# Altium project ic_tester.PrjPcb
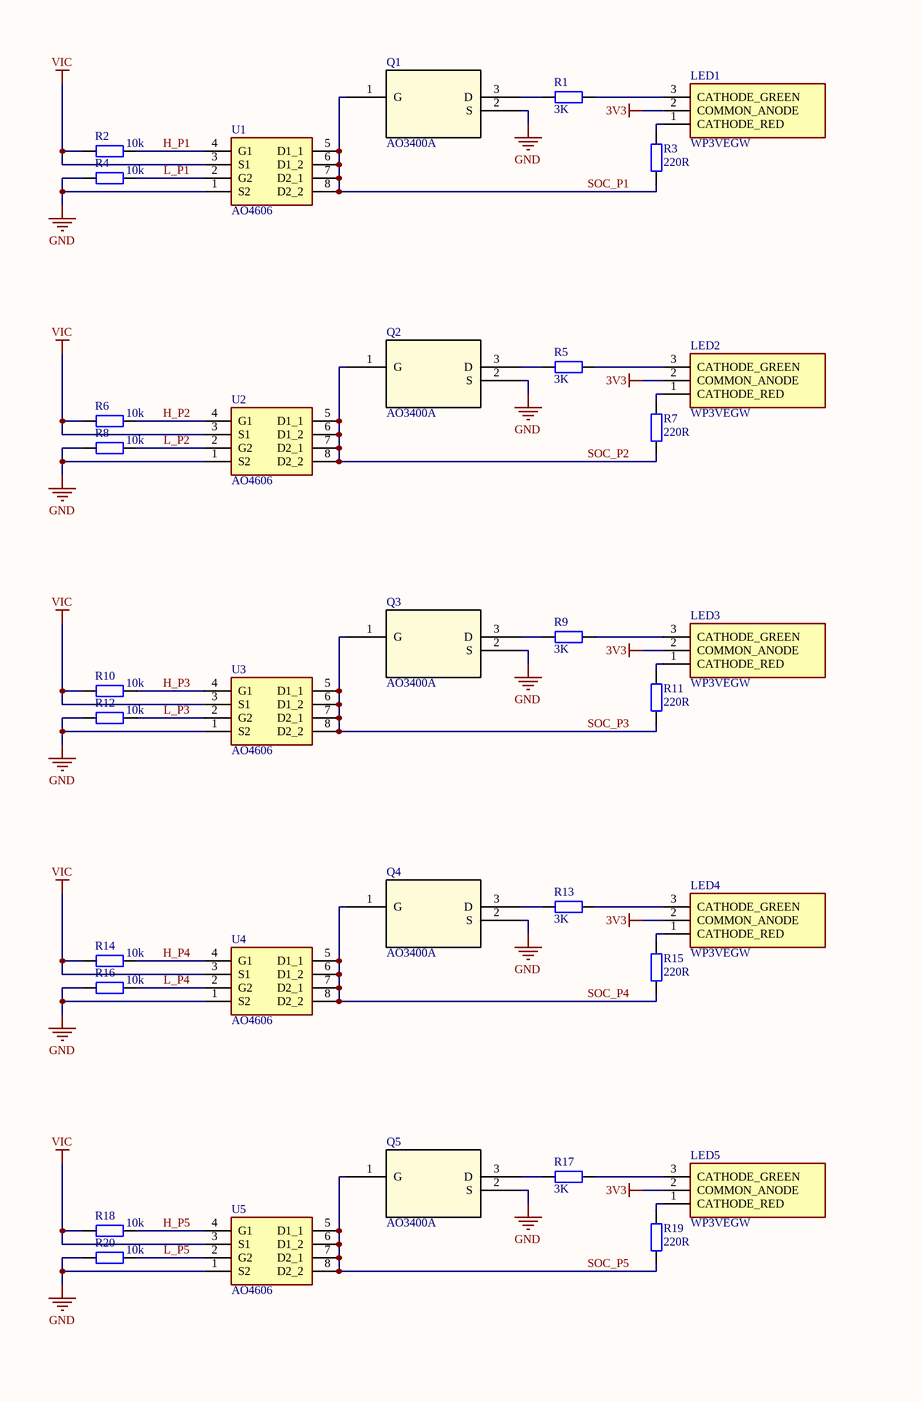
[diagram p0: data_left.SchDoc, top]
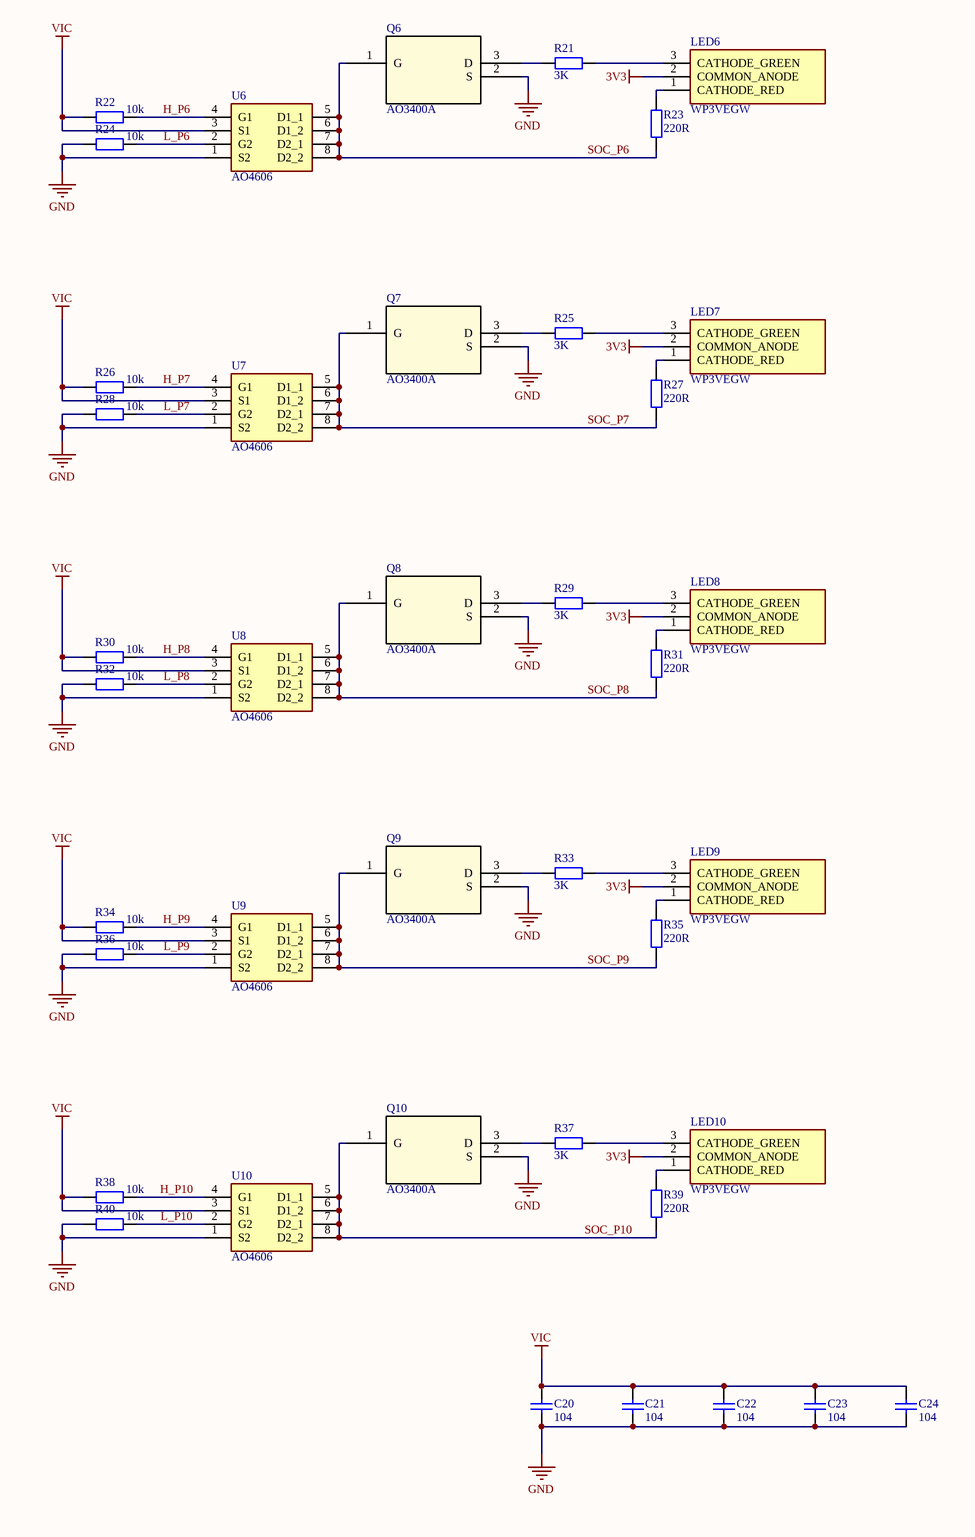
[diagram p1: data_left.SchDoc, bottom]
3 sheets, 236 parts. Net scope: global (net labels, ports and power ports of the same name join across sheets).
Board file: ic_tester.PcbDoc
Sheets:
  data_left.SchDoc
  data_right.SchDoc
  connect.SchDoc

## Sheet data_left.SchDoc
size 241 x 584 mm; SheetNumber: 1; SheetTotal: 3

### Parts
C20  104  [tu 0805]
C21  104  [tu 0805]
C22  104  [tu 0805]
C23  104  [tu 0805]
C24  104  [tu 0805]
LED1  WP3VEGW  [WP3VEGW]
LED2  WP3VEGW  [WP3VEGW]
LED3  WP3VEGW  [WP3VEGW]
LED4  WP3VEGW  [WP3VEGW]
LED5  WP3VEGW  [WP3VEGW]
LED6  WP3VEGW  [WP3VEGW]
LED7  WP3VEGW  [WP3VEGW]
LED8  WP3VEGW  [WP3VEGW]
LED9  WP3VEGW  [WP3VEGW]
LED10  WP3VEGW  [WP3VEGW]
Q1  AO3400A  [SOT-23-3L_AOS]
Q2  AO3400A  [SOT-23-3L_AOS]
Q3  AO3400A  [SOT-23-3L_AOS]
Q4  AO3400A  [SOT-23-3L_AOS]
Q5  AO3400A  [SOT-23-3L_AOS]
Q6  AO3400A  [SOT-23-3L_AOS]
Q7  AO3400A  [SOT-23-3L_AOS]
Q8  AO3400A  [SOT-23-3L_AOS]
Q9  AO3400A  [SOT-23-3L_AOS]
Q10  AO3400A  [SOT-23-3L_AOS]
R1  3K  [tro smd 0805]
R2  10k  [tro smd 0805]
R3  220R  [tro smd 0805]
R4  10k  [tro smd 0805]
R5  3K  [tro smd 0805]
R6  10k  [tro smd 0805]
R7  220R  [tro smd 0805]
R8  10k  [tro smd 0805]
R9  3K  [tro smd 0805]
R10  10k  [tro smd 0805]
R11  220R  [tro smd 0805]
R12  10k  [tro smd 0805]
R13  3K  [tro smd 0805]
R14  10k  [tro smd 0805]
R15  220R  [tro smd 0805]
R16  10k  [tro smd 0805]
R17  3K  [tro smd 0805]
R18  10k  [tro smd 0805]
R19  220R  [tro smd 0805]
R20  10k  [tro smd 0805]
R21  3K  [tro smd 0805]
R22  10k  [tro smd 0805]
R23  220R  [tro smd 0805]
R24  10k  [tro smd 0805]
R25  3K  [tro smd 0805]
R26  10k  [tro smd 0805]
R27  220R  [tro smd 0805]
R28  10k  [tro smd 0805]
R29  3K  [tro smd 0805]
R30  10k  [tro smd 0805]
R31  220R  [tro smd 0805]
R32  10k  [tro smd 0805]
R33  3K  [tro smd 0805]
R34  10k  [tro smd 0805]
R35  220R  [tro smd 0805]
R36  10k  [tro smd 0805]
R37  3K  [tro smd 0805]
R38  10k  [tro smd 0805]
R39  220R  [tro smd 0805]
R40  10k  [tro smd 0805]
U1  AO4606  [SOIC127P600X175-8N]
U2  AO4606  [SOIC127P600X175-8N]
U3  AO4606  [SOIC127P600X175-8N]
U4  AO4606  [SOIC127P600X175-8N]
U5  AO4606  [SOIC127P600X175-8N]
U6  AO4606  [SOIC127P600X175-8N]
U7  AO4606  [SOIC127P600X175-8N]
U8  AO4606  [SOIC127P600X175-8N]
U9  AO4606  [SOIC127P600X175-8N]
U10  AO4606  [SOIC127P600X175-8N]

### Nets
3V3: LED1.2(COMMON_ANODE) LED2.2(COMMON_ANODE) LED3.2(COMMON_ANODE) LED4.2(COMMON_ANODE) LED5.2(COMMON_ANODE) LED6.2(COMMON_ANODE) LED7.2(COMMON_ANODE) LED8.2(COMMON_ANODE) LED9.2(COMMON_ANODE) LED10.2(COMMON_ANODE)
GND: C20.2 C21.2 C22.2 C23.2 C24.2 Q1.2(S) Q2.2(S) Q3.2(S) Q4.2(S) Q5.2(S) Q6.2(S) Q7.2(S) Q8.2(S) Q9.2(S) Q10.2(S) R4.1 R8.1 R12.1 R16.1 R20.1 R24.1 R28.1 R32.1 R36.1 R40.1 U1.1(S2) U2.1(S2) U3.1(S2) U4.1(S2) U5.1(S2) U6.1(S2) U7.1(S2) U8.1(S2) U9.1(S2) U10.1(S2)
VIC: C20.1 C21.1 C22.1 C23.1 C24.1 R2.1 R6.1 R10.1 R14.1 R18.1 R22.1 R26.1 R30.1 R34.1 R38.1 U1.3(S1) U2.3(S1) U3.3(S1) U4.3(S1) U5.3(S1) U6.3(S1) U7.3(S1) U8.3(S1) U9.3(S1) U10.3(S1)
H_P1: R2.2 U1.4(G1)
H_P2: R6.2 U2.4(G1)
H_P3: R10.2 U3.4(G1)
H_P4: R14.2 U4.4(G1)
H_P5: R18.2 U5.4(G1)
H_P6: R22.2 U6.4(G1)
H_P7: R26.2 U7.4(G1)
H_P8: R30.2 U8.4(G1)
H_P9: R34.2 U9.4(G1)
H_P10: R38.2 U10.4(G1)
L_P1: R4.2 U1.2(G2)
L_P2: R8.2 U2.2(G2)
L_P3: R12.2 U3.2(G2)
L_P4: R16.2 U4.2(G2)
L_P5: R20.2 U5.2(G2)
L_P6: R24.2 U6.2(G2)
L_P7: R28.2 U7.2(G2)
L_P8: R32.2 U8.2(G2)
L_P9: R36.2 U9.2(G2)
L_P10: R40.2 U10.2(G2)
SOC_P1: Q1.1(G) R3.1 U1.5(D1_1) U1.6(D1_2) U1.7(D2_1) U1.8(D2_2)
SOC_P2: Q2.1(G) R7.1 U2.5(D1_1) U2.6(D1_2) U2.7(D2_1) U2.8(D2_2)
SOC_P3: Q3.1(G) R11.1 U3.5(D1_1) U3.6(D1_2) U3.7(D2_1) U3.8(D2_2)
SOC_P4: Q4.1(G) R15.1 U4.5(D1_1) U4.6(D1_2) U4.7(D2_1) U4.8(D2_2)
SOC_P5: Q5.1(G) R19.1 U5.5(D1_1) U5.6(D1_2) U5.7(D2_1) U5.8(D2_2)
SOC_P6: Q6.1(G) R23.1 U6.5(D1_1) U6.6(D1_2) U6.7(D2_1) U6.8(D2_2)
SOC_P7: Q7.1(G) R27.1 U7.5(D1_1) U7.6(D1_2) U7.7(D2_1) U7.8(D2_2)
SOC_P8: Q8.1(G) R31.1 U8.5(D1_1) U8.6(D1_2) U8.7(D2_1) U8.8(D2_2)
SOC_P9: Q9.1(G) R35.1 U9.5(D1_1) U9.6(D1_2) U9.7(D2_1) U9.8(D2_2)
SOC_P10: Q10.1(G) R39.1 U10.5(D1_1) U10.6(D1_2) U10.7(D2_1) U10.8(D2_2)
NetLED1_1: LED1.1(CATHODE_RED) R3.2
NetLED1_3: LED1.3(CATHODE_GREEN) R1.1
NetLED2_1: LED2.1(CATHODE_RED) R7.2
NetLED2_3: LED2.3(CATHODE_GREEN) R5.1
NetLED3_1: LED3.1(CATHODE_RED) R11.2
NetLED3_3: LED3.3(CATHODE_GREEN) R9.1
NetLED4_1: LED4.1(CATHODE_RED) R15.2
NetLED4_3: LED4.3(CATHODE_GREEN) R13.1
NetLED5_1: LED5.1(CATHODE_RED) R19.2
NetLED5_3: LED5.3(CATHODE_GREEN) R17.1
NetLED6_1: LED6.1(CATHODE_RED) R23.2
NetLED6_3: LED6.3(CATHODE_GREEN) R21.1
NetLED7_1: LED7.1(CATHODE_RED) R27.2
NetLED7_3: LED7.3(CATHODE_GREEN) R25.1
NetLED8_1: LED8.1(CATHODE_RED) R31.2
NetLED8_3: LED8.3(CATHODE_GREEN) R29.1
NetLED9_1: LED9.1(CATHODE_RED) R35.2
NetLED9_3: LED9.3(CATHODE_GREEN) R33.1
NetLED10_1: LED10.1(CATHODE_RED) R39.2
NetLED10_3: LED10.3(CATHODE_GREEN) R37.1
NetQ1_3: Q1.3(D) R1.2
NetQ2_3: Q2.3(D) R5.2
NetQ3_3: Q3.3(D) R9.2
NetQ4_3: Q4.3(D) R13.2
NetQ5_3: Q5.3(D) R17.2
NetQ6_3: Q6.3(D) R21.2
NetQ7_3: Q7.3(D) R25.2
NetQ8_3: Q8.3(D) R29.2
NetQ9_3: Q9.3(D) R33.2
NetQ10_3: Q10.3(D) R37.2

### Library data of the parts
C20-C24 = Tu 0805 106 16V 10%: Dán; Ten_Linh_Kien: Tụ 0805 106-10uF 10% 16V; So_Chan: 2; Don_Vi: Con; Ma_Hang: MH004553; Chung_Loai: Dán; Kieu_Chan: *
LED1-LED10 = WP3VEGW: LED RED/GREEN 3mm; Manufacturer_Name: Kingbright; Datasheet Link: https://www.mouser.com/datasheet/2/216/WP3VEGW-47873.pdf; Height: 6.93mm; Manufacturer_Part_Number: WP3VEGW; Mouser Part Number: 604-WP3VEGW; Mouser Price/Stock: https://www.mouser.co.uk/ProductDetail/Kingbright/WP3VEGW?qs=58z0TXQGVSS6OtgxGPtI4A%3D%3D; Arrow Part Number: WP3VEGW; Arrow Price/Stock: https://www.arrow.com/en/products/wp3vegw/kingbright?region=nac
Q1-Q10 = AO3400A: N-MOSFET; Mfr_Name: Alpha and Omega Semiconductor; Type: DEV; Copyright: Copyright (C) 2023 Ultra Librarian. All rights reserved.; Manufacturer_Part_Number: AO3400A; RefDes: RefDes
R1-R40 = Tro 0805 1% 10k: Dán; Don_Vi: Con; So_Chan: 2; Ten_Linh_Kien: Trở 0805 1% 10k; Ma_Hang: MH005473; Chung_Loai: Dán; Kieu_Chan: *
U1-U10 = AO4606: SMALL SIGNAL FIELD-EFFECT TRANSISTOR, 6A I(D), 30V, 2-ELEMENT, N-CHANNEL AND P-CHANNEL, SILICON, METAL-OXIDE SEMICONDUCTOR FET; Manufacturer_Name: Alpha & Omega Semiconductors; Geometry.Height: 1.75mm; Manufacturer_Part_Number: AO4606; Mouser Part Number: *; Mouser Price/Stock: *; Arrow Part Number: AO4606; Arrow Price/Stock: https://www.arrow.com/en/products/ao4606/alpha-and-omega-semiconductor?region=nac; Datasheet Link: https://datasheet.datasheetarchive.com/originals/distributors/Datasheets-AOS/DSAAOS100079.pdf

## Sheet data_right.SchDoc
size 241 x 584 mm; SheetNumber: 2; SheetTotal: 3
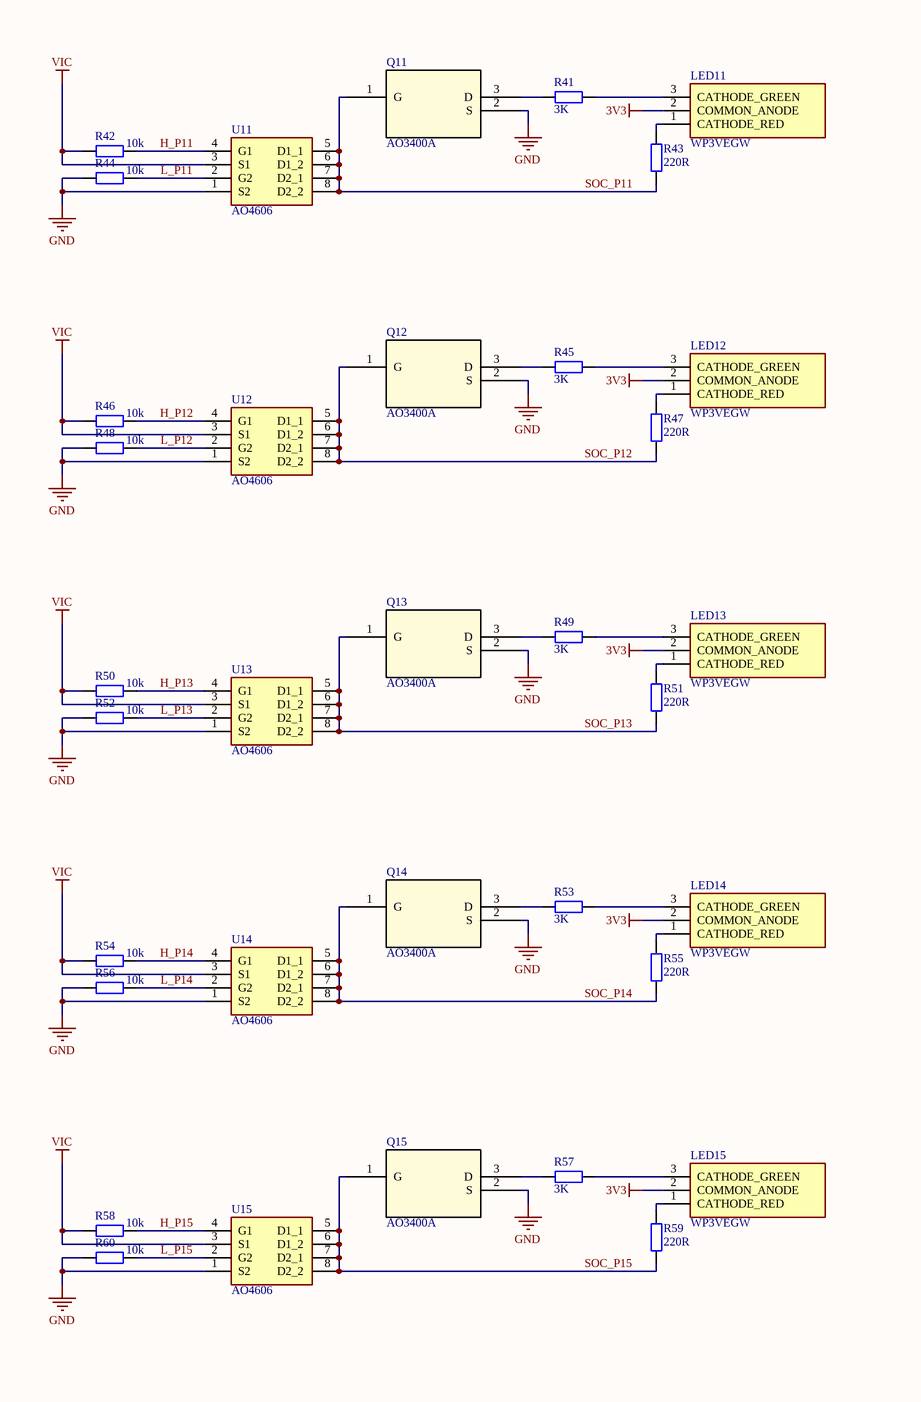
[diagram p2: data_right.SchDoc, top]
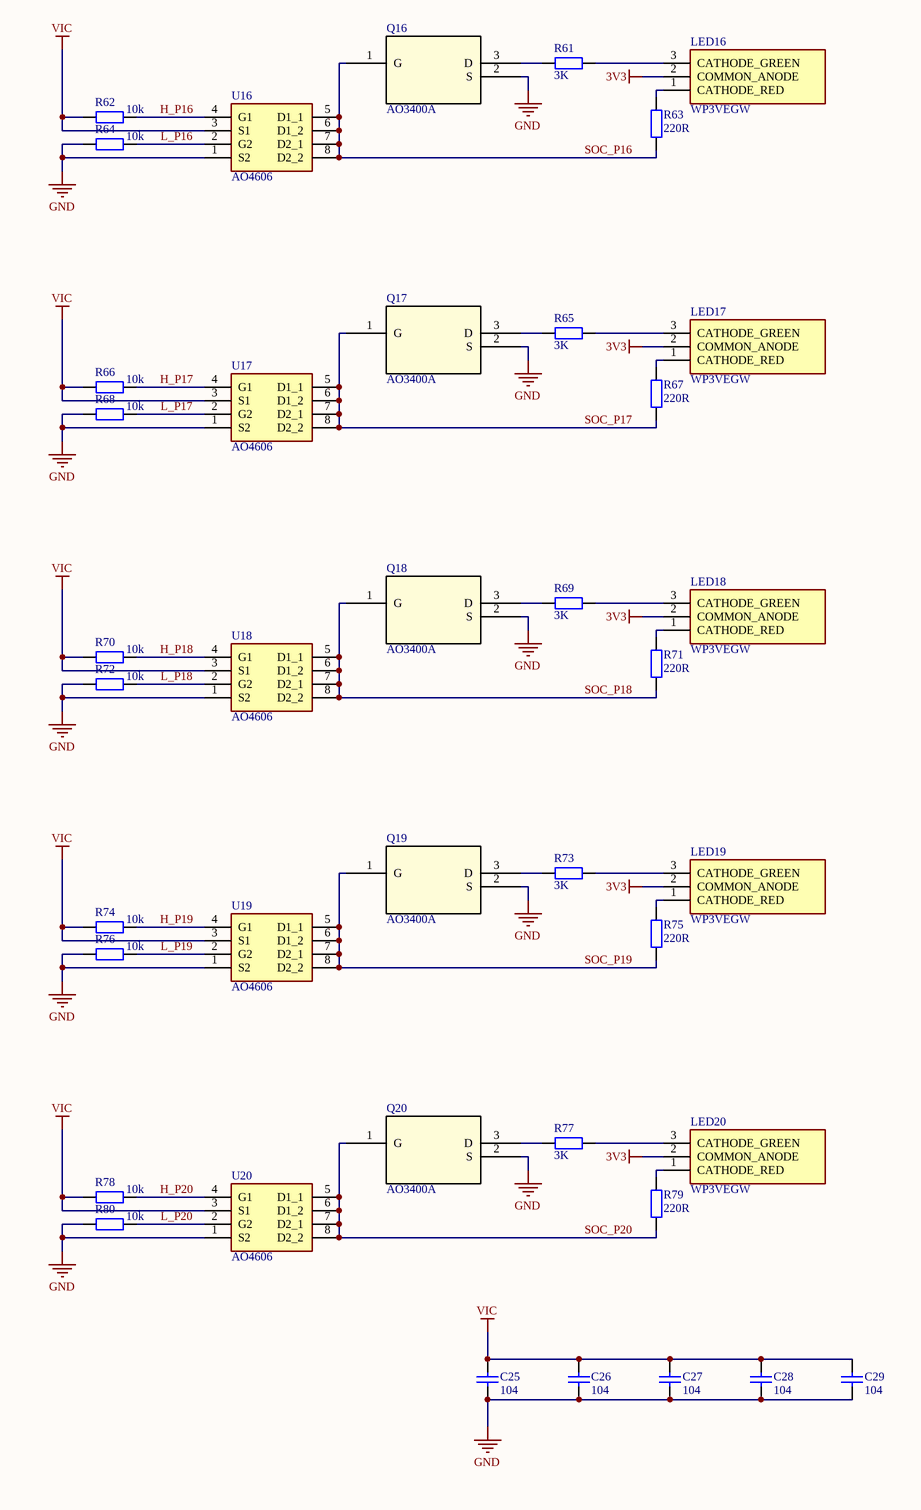
[diagram p3: data_right.SchDoc, bottom]

### Parts
C25  104  [tu 0805]
C26  104  [tu 0805]
C27  104  [tu 0805]
C28  104  [tu 0805]
C29  104  [tu 0805]
LED11  WP3VEGW  [WP3VEGW]
LED12  WP3VEGW  [WP3VEGW]
LED13  WP3VEGW  [WP3VEGW]
LED14  WP3VEGW  [WP3VEGW]
LED15  WP3VEGW  [WP3VEGW]
LED16  WP3VEGW  [WP3VEGW]
LED17  WP3VEGW  [WP3VEGW]
LED18  WP3VEGW  [WP3VEGW]
LED19  WP3VEGW  [WP3VEGW]
LED20  WP3VEGW  [WP3VEGW]
Q11  AO3400A  [SOT-23-3L_AOS]
Q12  AO3400A  [SOT-23-3L_AOS]
Q13  AO3400A  [SOT-23-3L_AOS]
Q14  AO3400A  [SOT-23-3L_AOS]
Q15  AO3400A  [SOT-23-3L_AOS]
Q16  AO3400A  [SOT-23-3L_AOS]
Q17  AO3400A  [SOT-23-3L_AOS]
Q18  AO3400A  [SOT-23-3L_AOS]
Q19  AO3400A  [SOT-23-3L_AOS]
Q20  AO3400A  [SOT-23-3L_AOS]
R41  3K  [tro smd 0805]
R42  10k  [tro smd 0805]
R43  220R  [tro smd 0805]
R44  10k  [tro smd 0805]
R45  3K  [tro smd 0805]
R46  10k  [tro smd 0805]
R47  220R  [tro smd 0805]
R48  10k  [tro smd 0805]
R49  3K  [tro smd 0805]
R50  10k  [tro smd 0805]
R51  220R  [tro smd 0805]
R52  10k  [tro smd 0805]
R53  3K  [tro smd 0805]
R54  10k  [tro smd 0805]
R55  220R  [tro smd 0805]
R56  10k  [tro smd 0805]
R57  3K  [tro smd 0805]
R58  10k  [tro smd 0805]
R59  220R  [tro smd 0805]
R60  10k  [tro smd 0805]
R61  3K  [tro smd 0805]
R62  10k  [tro smd 0805]
R63  220R  [tro smd 0805]
R64  10k  [tro smd 0805]
R65  3K  [tro smd 0805]
R66  10k  [tro smd 0805]
R67  220R  [tro smd 0805]
R68  10k  [tro smd 0805]
R69  3K  [tro smd 0805]
R70  10k  [tro smd 0805]
R71  220R  [tro smd 0805]
R72  10k  [tro smd 0805]
R73  3K  [tro smd 0805]
R74  10k  [tro smd 0805]
R75  220R  [tro smd 0805]
R76  10k  [tro smd 0805]
R77  3K  [tro smd 0805]
R78  10k  [tro smd 0805]
R79  220R  [tro smd 0805]
R80  10k  [tro smd 0805]
U11  AO4606  [SOIC127P600X175-8N]
U12  AO4606  [SOIC127P600X175-8N]
U13  AO4606  [SOIC127P600X175-8N]
U14  AO4606  [SOIC127P600X175-8N]
U15  AO4606  [SOIC127P600X175-8N]
U16  AO4606  [SOIC127P600X175-8N]
U17  AO4606  [SOIC127P600X175-8N]
U18  AO4606  [SOIC127P600X175-8N]
U19  AO4606  [SOIC127P600X175-8N]
U20  AO4606  [SOIC127P600X175-8N]

### Nets
3V3: LED11.2(COMMON_ANODE) LED12.2(COMMON_ANODE) LED13.2(COMMON_ANODE) LED14.2(COMMON_ANODE) LED15.2(COMMON_ANODE) LED16.2(COMMON_ANODE) LED17.2(COMMON_ANODE) LED18.2(COMMON_ANODE) LED19.2(COMMON_ANODE) LED20.2(COMMON_ANODE)
GND: C25.2 C26.2 C27.2 C28.2 C29.2 Q11.2(S) Q12.2(S) Q13.2(S) Q14.2(S) Q15.2(S) Q16.2(S) Q17.2(S) Q18.2(S) Q19.2(S) Q20.2(S) R44.1 R48.1 R52.1 R56.1 R60.1 R64.1 R68.1 R72.1 R76.1 R80.1 U11.1(S2) U12.1(S2) U13.1(S2) U14.1(S2) U15.1(S2) U16.1(S2) U17.1(S2) U18.1(S2) U19.1(S2) U20.1(S2)
VIC: C25.1 C26.1 C27.1 C28.1 C29.1 R42.1 R46.1 R50.1 R54.1 R58.1 R62.1 R66.1 R70.1 R74.1 R78.1 U11.3(S1) U12.3(S1) U13.3(S1) U14.3(S1) U15.3(S1) U16.3(S1) U17.3(S1) U18.3(S1) U19.3(S1) U20.3(S1)
H_P11: R42.2 U11.4(G1)
H_P12: R46.2 U12.4(G1)
H_P13: R50.2 U13.4(G1)
H_P14: R54.2 U14.4(G1)
H_P15: R58.2 U15.4(G1)
H_P16: R62.2 U16.4(G1)
H_P17: R66.2 U17.4(G1)
H_P18: R70.2 U18.4(G1)
H_P19: R74.2 U19.4(G1)
H_P20: R78.2 U20.4(G1)
L_P11: R44.2 U11.2(G2)
L_P12: R48.2 U12.2(G2)
L_P13: R52.2 U13.2(G2)
L_P14: R56.2 U14.2(G2)
L_P15: R60.2 U15.2(G2)
L_P16: R64.2 U16.2(G2)
L_P17: R68.2 U17.2(G2)
L_P18: R72.2 U18.2(G2)
L_P19: R76.2 U19.2(G2)
L_P20: R80.2 U20.2(G2)
SOC_P11: Q11.1(G) R43.1 U11.5(D1_1) U11.6(D1_2) U11.7(D2_1) U11.8(D2_2)
SOC_P12: Q12.1(G) R47.1 U12.5(D1_1) U12.6(D1_2) U12.7(D2_1) U12.8(D2_2)
SOC_P13: Q13.1(G) R51.1 U13.5(D1_1) U13.6(D1_2) U13.7(D2_1) U13.8(D2_2)
SOC_P14: Q14.1(G) R55.1 U14.5(D1_1) U14.6(D1_2) U14.7(D2_1) U14.8(D2_2)
SOC_P15: Q15.1(G) R59.1 U15.5(D1_1) U15.6(D1_2) U15.7(D2_1) U15.8(D2_2)
SOC_P16: Q16.1(G) R63.1 U16.5(D1_1) U16.6(D1_2) U16.7(D2_1) U16.8(D2_2)
SOC_P17: Q17.1(G) R67.1 U17.5(D1_1) U17.6(D1_2) U17.7(D2_1) U17.8(D2_2)
SOC_P18: Q18.1(G) R71.1 U18.5(D1_1) U18.6(D1_2) U18.7(D2_1) U18.8(D2_2)
SOC_P19: Q19.1(G) R75.1 U19.5(D1_1) U19.6(D1_2) U19.7(D2_1) U19.8(D2_2)
SOC_P20: Q20.1(G) R79.1 U20.5(D1_1) U20.6(D1_2) U20.7(D2_1) U20.8(D2_2)
NetLED11_1: LED11.1(CATHODE_RED) R43.2
NetLED11_3: LED11.3(CATHODE_GREEN) R41.1
NetLED12_1: LED12.1(CATHODE_RED) R47.2
NetLED12_3: LED12.3(CATHODE_GREEN) R45.1
NetLED13_1: LED13.1(CATHODE_RED) R51.2
NetLED13_3: LED13.3(CATHODE_GREEN) R49.1
NetLED14_1: LED14.1(CATHODE_RED) R55.2
NetLED14_3: LED14.3(CATHODE_GREEN) R53.1
NetLED15_1: LED15.1(CATHODE_RED) R59.2
NetLED15_3: LED15.3(CATHODE_GREEN) R57.1
NetLED16_1: LED16.1(CATHODE_RED) R63.2
NetLED16_3: LED16.3(CATHODE_GREEN) R61.1
NetLED17_1: LED17.1(CATHODE_RED) R67.2
NetLED17_3: LED17.3(CATHODE_GREEN) R65.1
NetLED18_1: LED18.1(CATHODE_RED) R71.2
NetLED18_3: LED18.3(CATHODE_GREEN) R69.1
NetLED19_1: LED19.1(CATHODE_RED) R75.2
NetLED19_3: LED19.3(CATHODE_GREEN) R73.1
NetLED20_1: LED20.1(CATHODE_RED) R79.2
NetLED20_3: LED20.3(CATHODE_GREEN) R77.1
NetQ11_3: Q11.3(D) R41.2
NetQ12_3: Q12.3(D) R45.2
NetQ13_3: Q13.3(D) R49.2
NetQ14_3: Q14.3(D) R53.2
NetQ15_3: Q15.3(D) R57.2
NetQ16_3: Q16.3(D) R61.2
NetQ17_3: Q17.3(D) R65.2
NetQ18_3: Q18.3(D) R69.2
NetQ19_3: Q19.3(D) R73.2
NetQ20_3: Q20.3(D) R77.2

### Library data of the parts
C25-C29 = Tu 0805 106 16V 10%: as C20 on sheet data_left; Chung_Loai: Dán; Kieu_Chan: *
LED11-LED20 = WP3VEGW: as LED1 on sheet data_left; Datasheet Link: https://www.mouser.com/datasheet/2/216/WP3VEGW-47873.pdf; Height: 6.93mm; Manufacturer_Part_Number: WP3VEGW; Mouser Part Number: 604-WP3VEGW; Mouser Price/Stock: https://www.mouser.co.uk/ProductDetail/Kingbright/WP3VEGW?qs=58z0TXQGVSS6OtgxGPtI4A%3D%3D; Arrow Part Number: WP3VEGW; Arrow Price/Stock: https://www.arrow.com/en/products/wp3vegw/kingbright?region=nac
Q11-Q20 = AO3400A: as Q1 on sheet data_left; Copyright: Copyright (C) 2023 Ultra Librarian. All rights reserved.; Manufacturer_Part_Number: AO3400A; RefDes: RefDes
R41-R80 = Tro 0805 1% 10k: as R1 on sheet data_left; Chung_Loai: Dán; Kieu_Chan: *
U11-U20 = AO4606: as U1 on sheet data_left; Manufacturer_Part_Number: AO4606; Mouser Part Number: *; Mouser Price/Stock: *; Arrow Part Number: AO4606; Arrow Price/Stock: https://www.arrow.com/en/products/ao4606/alpha-and-omega-semiconductor?region=nac; Datasheet Link: https://datasheet.datasheetarchive.com/originals/distributors/Datasheets-AOS/DSAAOS100079.pdf

## Sheet connect.SchDoc
size A2; SheetNumber: 3; SheetTotal: 3
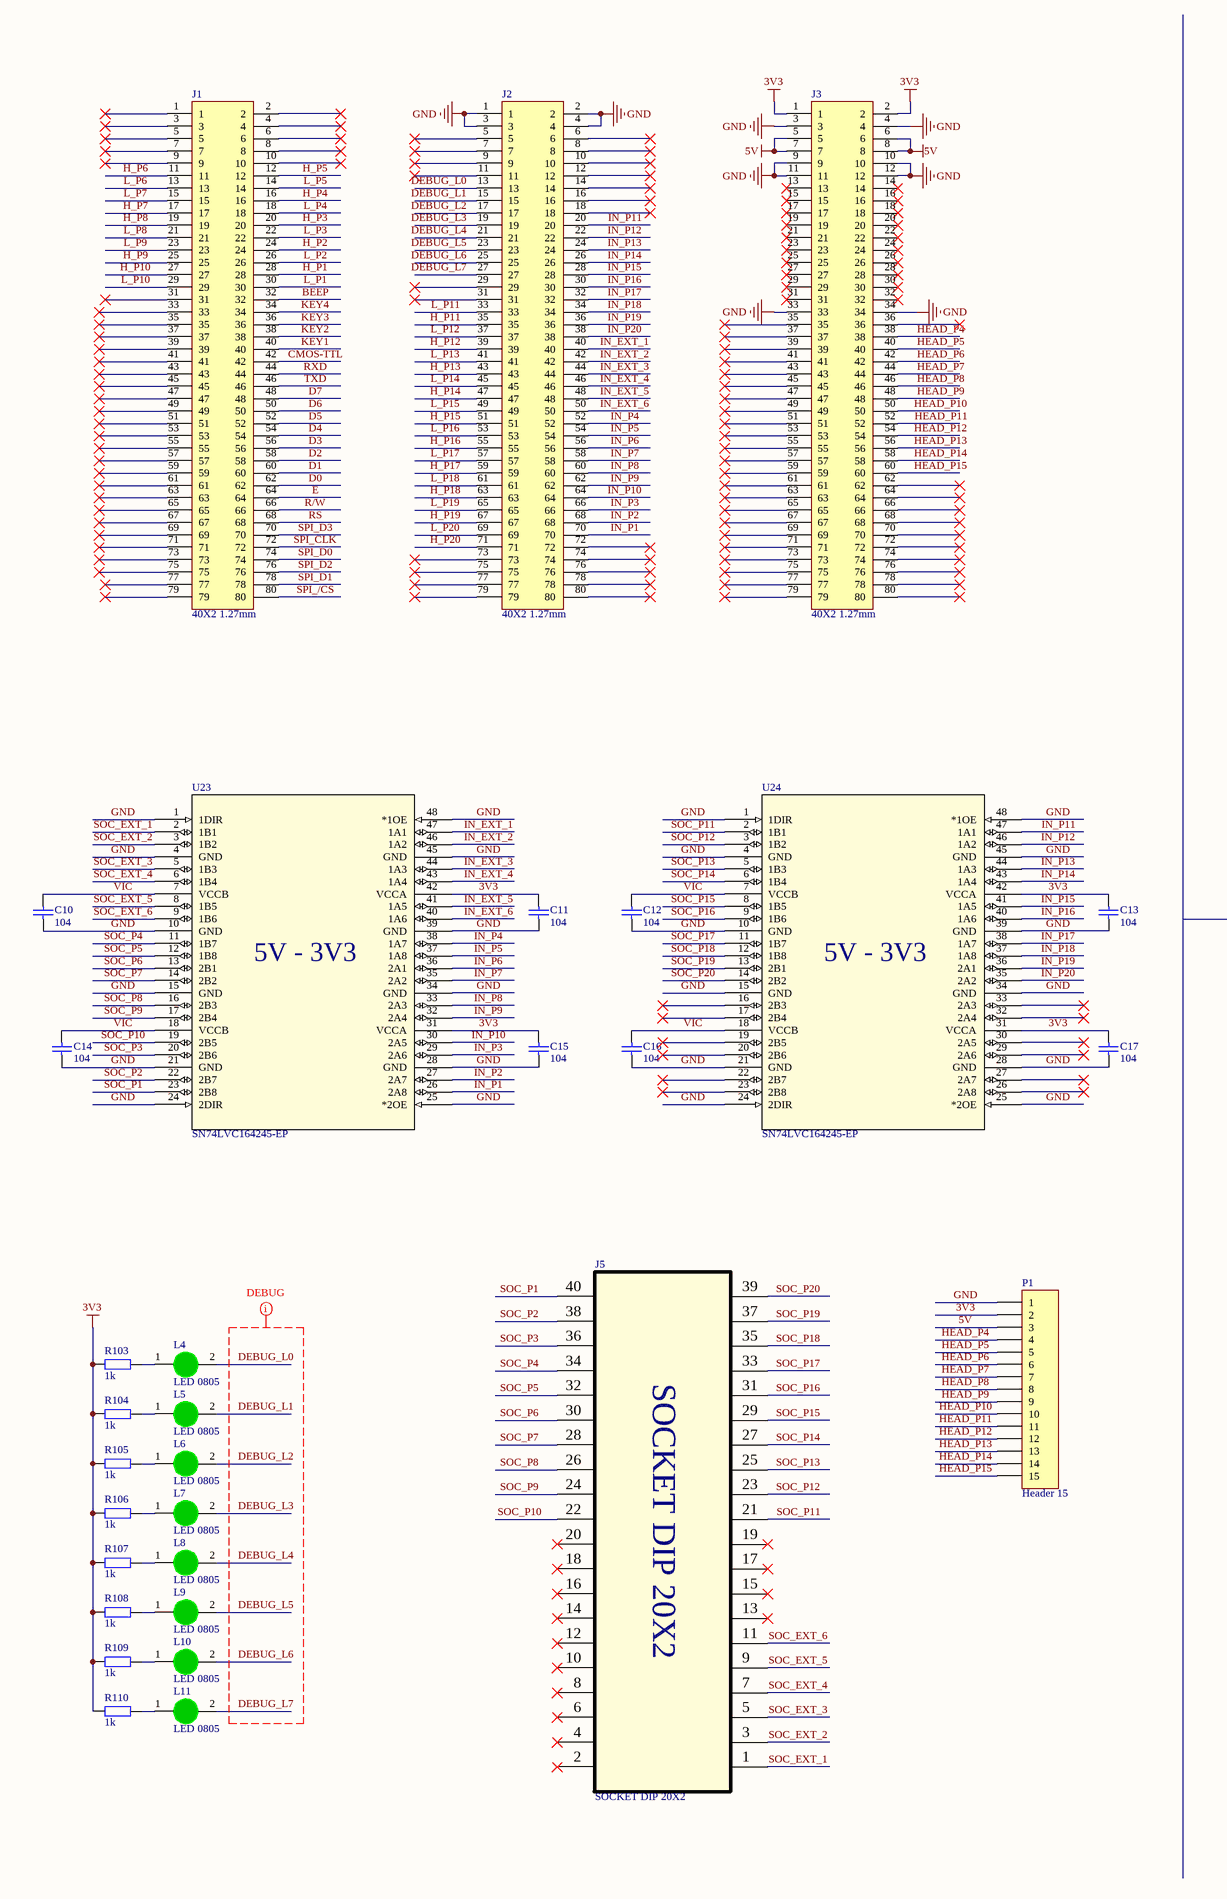
[diagram p4: connect.SchDoc, left]
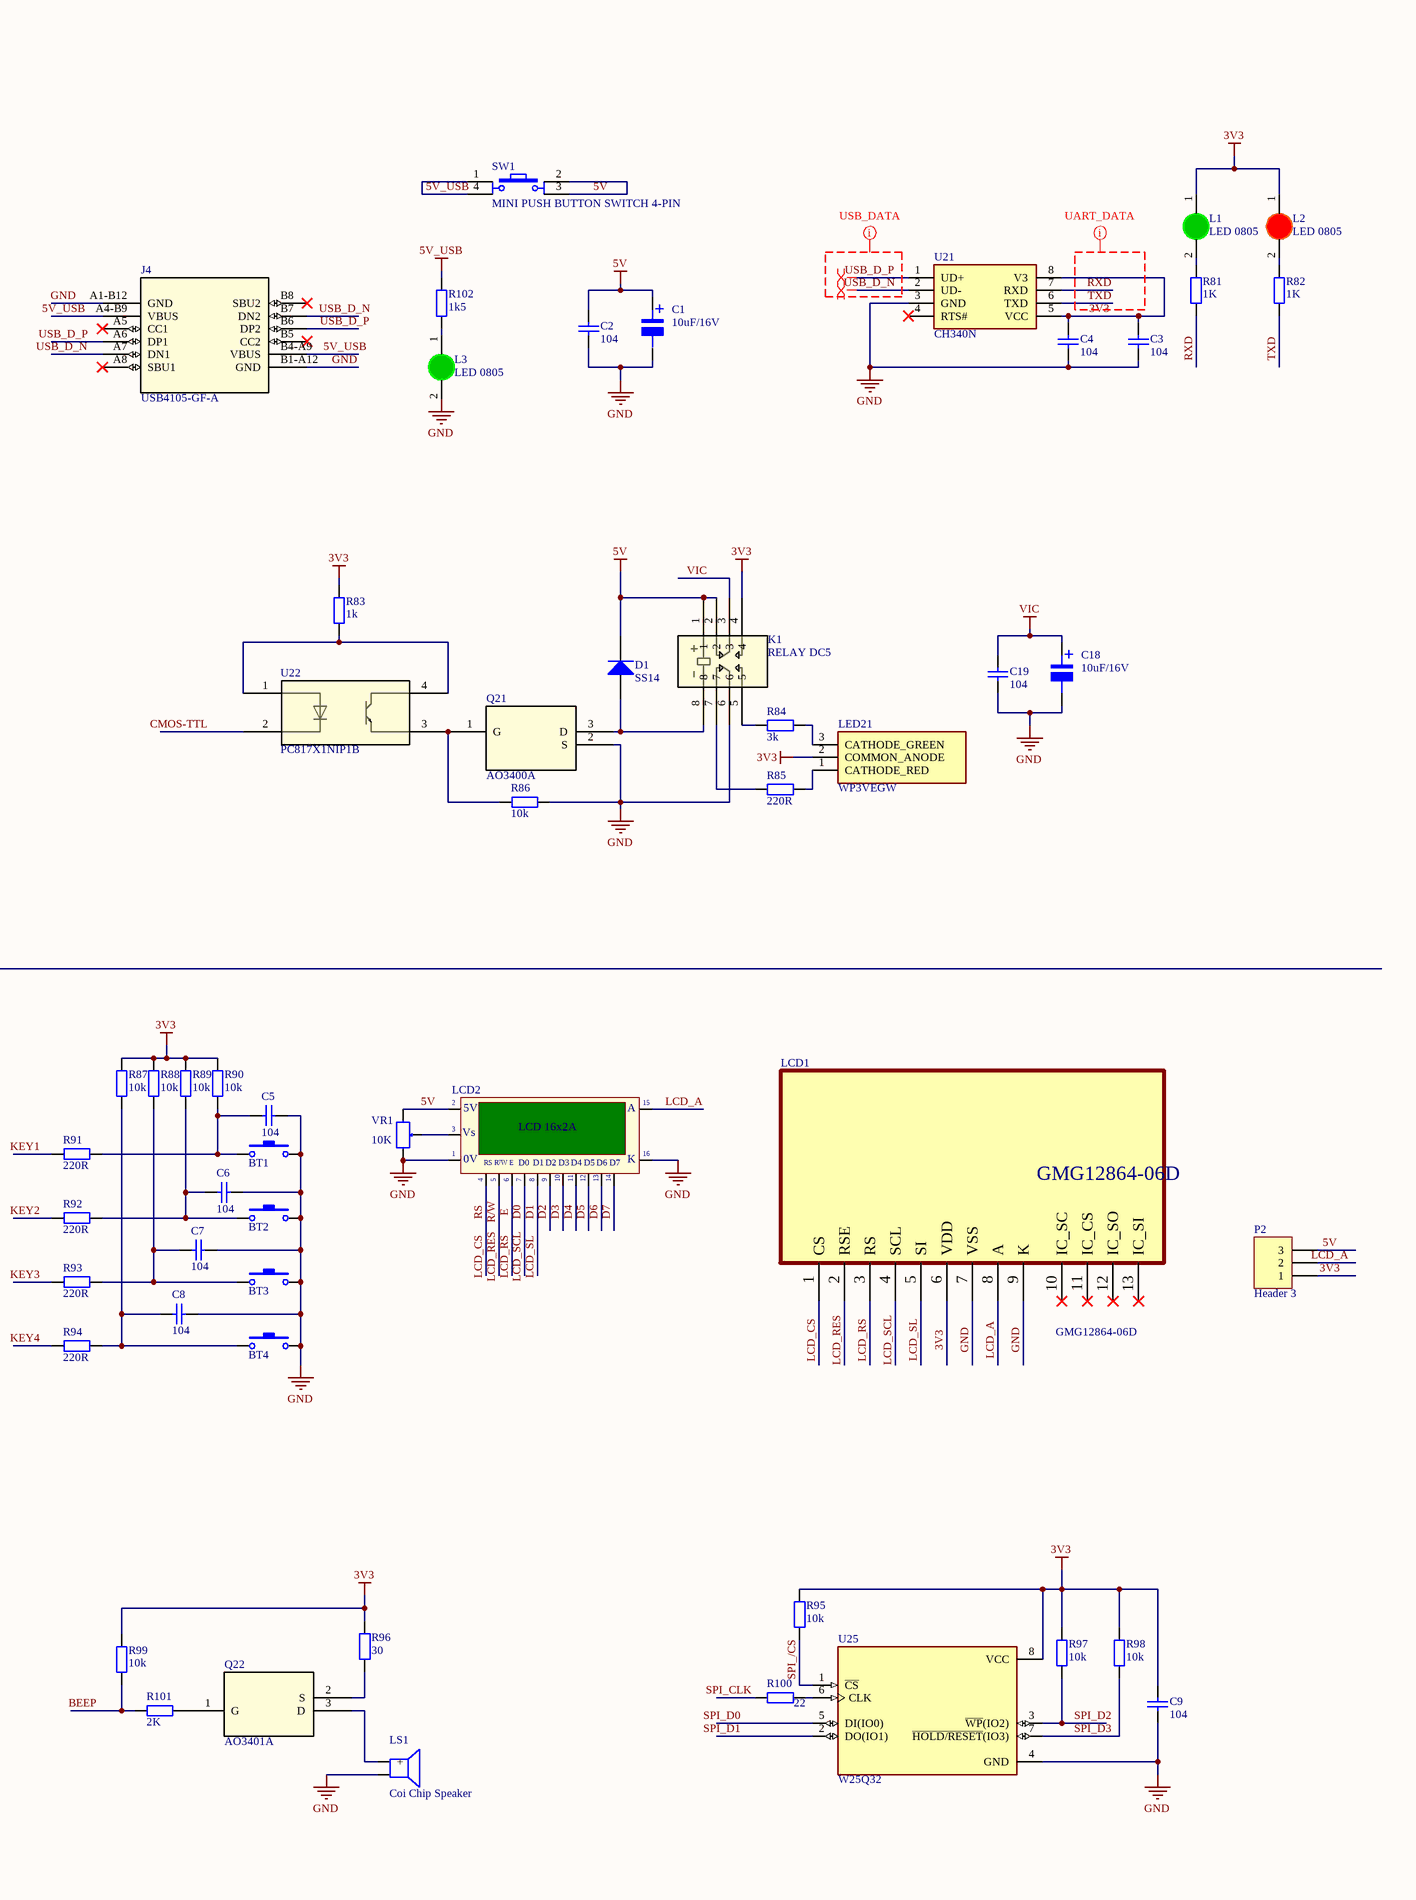
[diagram p5: connect.SchDoc, right]

### Parts
BT1  Nut Nhan 2 Chan SMD 3x6x2.5  [Nut Nhan 2 Chan SMD 3x6x2.5]  (value not drawn)
BT2  Nut Nhan 2 Chan SMD 3x6x2.5  [Nut Nhan 2 Chan SMD 3x6x2.5]  (value not drawn)
BT3  Nut Nhan 2 Chan SMD 3x6x2.5  [Nut Nhan 2 Chan SMD 3x6x2.5]  (value not drawn)
BT4  Nut Nhan 2 Chan SMD 3x6x2.5  [Nut Nhan 2 Chan SMD 3x6x2.5]  (value not drawn)
C1  10uF/16V  [tu nhom 4 (b)]
C2  104  [tu 0805]
C3  104  [tu 0805]
C4  104  [tu 0805]
C5  104  [tu 0805]
C6  104  [tu 0805]
C7  104  [tu 0805]
C8  104  [tu 0805]
C9  104  [tu 0805]
C10  104  [Tu 0805]
C11  104  [Tu 0805]
C12  104  [Tu 0805]
C13  104  [Tu 0805]
C14  104  [Tu 0805]
C15  104  [Tu 0805]
C16  104  [Tu 0805]
C17  104  [Tu 0805]
C18  10uF/16V  [tu nhom 4 (b)]
C19  104  [tu 0805]
D1  SS14  [DIODE SMA]
J1  40X2 1.27mm  [CLP-140-02-XXX-D-A]
J2  40X2 1.27mm  [CLP-140-02-XXX-D-A]
J3  40X2 1.27mm  [CLP-140-02-XXX-D-A]
J4  USB4105-GF-A  [USB4105_GCT]
J5  SOCKET DIP 20X2  [CONN40_40-6554_ARS]
K1  RELAY DC5  [G6K-2F-Y DC3_OMR]
L1  LED 0805  [LED-0805-Green]
L2  LED 0805  [LED-0805-Red]
L3  LED 0805  [LED-0805-Green]
L4  LED 0805  [LED-0805-Green]
L5  LED 0805  [LED-0805-Green]
L6  LED 0805  [LED-0805-Green]
L7  LED 0805  [LED-0805-Green]
L8  LED 0805  [LED-0805-Green]
L9  LED 0805  [LED-0805-Green]
L10  LED 0805  [LED-0805-Green]
L11  LED 0805  [LED-0805-Green]
LCD1  GMG12864-06D  [GMG12864-06D]
LCD2  LCD 16x2A  [LCD16X2N]
LED21  WP3VEGW  [WP3VEGW]
LS1  Coi Chip Speaker  [Coi Chip Speacker]
P1  Header 15  [HDR1X15]
P2  Header 3  [HDR1X3]
Q21  AO3400A  [SOT-23-3L_AOS]
Q22  AO3401A  [SOT-23-3L_AOS]
R81  1K  [tro smd 0805]
R82  1K  [tro smd 0805]
R83  1k  [tro smd 0805]
R84  3k  [tro smd 0805]
R85  220R  [tro smd 0805]
R86  10k  [tro smd 0805]
R87  10k  [tro smd 0805]
R88  10k  [tro smd 0805]
R89  10k  [tro smd 0805]
R90  10k  [tro smd 0805]
R91  220R  [tro smd 0805]
R92  220R  [tro smd 0805]
R93  220R  [tro smd 0805]
R94  220R  [tro smd 0805]
R95  10k  [tro smd 0805]
R96  30  [tro smd 0805]
R97  10k  [tro smd 0805]
R98  10k  [tro smd 0805]
R99  10k  [tro smd 0805]
R100  22  [tro smd 0805]
R101  2K  [tro smd 0805]
R102  1k5  [tro smd 0805]
R103  1k  [tro smd 0805]
R104  1k  [tro smd 0805]
R105  1k  [tro smd 0805]
R106  1k  [tro smd 0805]
R107  1k  [tro smd 0805]
R108  1k  [tro smd 0805]
R109  1k  [tro smd 0805]
R110  1k  [tro smd 0805]
SW1  MINI PUSH BUTTON SWITCH 4-PIN  [SW_70_31.5D47_TH_ST]
U21  CH340N  [SOIC127P600X175-8N]
U22  PC817X1NIP1B  [PC817XI_SHP]
U23  SN74LVC164245-EP  [DGG48]
U24  SN74LVC164245-EP  [DGG48]
U25  W25Q32  [WIN_SS-8_WIN]
VR1  10K  [3362P_1]

### Nets
3V3: C3.1 C4.1 C9.1 C11.2 C13.2 C15.2 C17.2 J3.1 J3.2 K1.4 L1.1(A) L2.1(A) LCD1.6(VDD) LED21.2(COMMON_ANODE) P1.2 P2.1 R83.2 R87.2 R88.2 R89.2 R90.2 R95.2 R96.2 R97.2 R98.2 R99.2 R103.1 R104.1 R105.1 R106.1 R107.1 R108.1 R109.1 R110.1 U21.5(VCC) U21.8(V3) U23.31(VCCA) U23.42(VCCA) U24.31(VCCA) U24.42(VCCA) U25.8(VCC)
5V: C1.1 C2.1 D1.2(K) J3.5 J3.6 J3.7 J3.8 K1.1 K1.2 LCD2.2(VDD) P1.3 P2.3 SW1.2 SW1.3 VR1.1
5V_USB: J4.A4-B9(VBUS) J4.B4-A9(VBUS) R102.1 SW1.1 SW1.4
GND: BT1.2 BT2.2 BT3.2 BT4.2 C1.2 C2.2 C3.2 C4.2 C5.1 C6.1 C7.1 C8.1 C9.2 C10.1 C11.1 C12.1 C13.1 C14.1 C15.1 C16.1 C17.1 C18.2 C19.2 J2.1 J2.2 J2.3 J2.4 J3.3 J3.4 J3.9 J3.10 J3.11 J3.12 J3.33 J3.34 J4.A1-B12(GND) J4.B1-A12(GND) K1.6 L3.2(K) LCD1.7(VSS) LCD1.9(K) LCD2.1(GND) LCD2.16(K) LS1.2 P1.1 Q21.2(S) R86.2 U21.3(GND) U23.1(1DIR) U23.4(GND) U23.10(GND) U23.15(GND) U23.21(GND) U23.24(2DIR) U23.25(*2OE) U23.28(GND) U23.34(GND) U23.39(GND) U23.45(GND) U23.48(*1OE) U24.1(1DIR) U24.4(GND) U24.10(GND) U24.15(GND) U24.21(GND) U24.24(2DIR) U24.25(*2OE) U24.28(GND) U24.34(GND) U24.39(GND) U24.45(GND) U24.48(*1OE) U25.4(GND) VR1.3
VIC: C10.2 C12.2 C14.2 C16.2 C18.1 C19.1 K1.3 U23.7(VCCB) U23.18(VCCB) U24.7(VCCB) U24.18(VCCB)
BEEP: J1.32 R99.1 R101.1
CMOS-TTL: J1.42 U22.2
D0: J1.62 LCD1.4(SCL) LCD2.7(D0)  [also labelled LCD_SCL]
D1: J1.60 LCD1.5(SI) LCD2.8(D1)  [also labelled LCD_SL]
D2: J1.58 LCD2.9(D2)
D3: J1.56 LCD2.10(D3)
D4: J1.54 LCD2.11(D4)
D5: J1.52 LCD2.12(D5)
D6: J1.50 LCD2.13(D6)
D7: J1.48 LCD2.14(D7)
DEBUG_L0: J2.13 L4.2(K)
DEBUG_L1: J2.15 L5.2(K)
DEBUG_L2: J2.17 L6.2(K)
DEBUG_L3: J2.19 L7.2(K)
DEBUG_L4: J2.21 L8.2(K)
DEBUG_L5: J2.23 L9.2(K)
DEBUG_L6: J2.25 L10.2(K)
DEBUG_L7: J2.27 L11.2(K)
E: J1.64 LCD1.3(RS) LCD2.6(~{EN})  [also labelled LCD_RS]
H_P1: J1.28
H_P2: J1.24
H_P3: J1.20
H_P4: J1.16
H_P5: J1.12
H_P6: J1.11
H_P7: J1.17
H_P8: J1.19
H_P9: J1.25
H_P10: J1.27
H_P11: J2.35
H_P12: J2.39
H_P13: J2.43
H_P14: J2.47
H_P15: J2.51
H_P16: J2.55
H_P17: J2.59
H_P18: J2.63
H_P19: J2.67
H_P20: J2.71
HEAD_P4: J3.38 P1.4
HEAD_P5: J3.40 P1.5
HEAD_P6: J3.42 P1.6
HEAD_P7: J3.44 P1.7
HEAD_P8: J3.46 P1.8
HEAD_P9: J3.48 P1.9
HEAD_P10: J3.50 P1.10
HEAD_P11: J3.52 P1.11
HEAD_P12: J3.54 P1.12
HEAD_P13: J3.56 P1.13
HEAD_P14: J3.58 P1.14
HEAD_P15: J3.60 P1.15
IN_EXT_1: J2.40 U23.47(1A1)
IN_EXT_2: J2.42 U23.46(1A2)
IN_EXT_3: J2.44 U23.44(1A3)
IN_EXT_4: J2.46 U23.43(1A4)
IN_EXT_5: J2.48 U23.41(1A5)
IN_EXT_6: J2.50 U23.40(1A6)
IN_P1: J2.70 U23.26(2A8)
IN_P2: J2.68 U23.27(2A7)
IN_P3: J2.66 U23.29(2A6)
IN_P4: J2.52 U23.38(1A7)
IN_P5: J2.54 U23.37(1A8)
IN_P6: J2.56 U23.36(2A1)
IN_P7: J2.58 U23.35(2A2)
IN_P8: J2.60 U23.33(2A3)
IN_P9: J2.62 U23.32(2A4)
IN_P10: J2.64 U23.30(2A5)
IN_P11: J2.20 U24.47(1A1)
IN_P12: J2.22 U24.46(1A2)
IN_P13: J2.24 U24.44(1A3)
IN_P14: J2.26 U24.43(1A4)
IN_P15: J2.28 U24.41(1A5)
IN_P16: J2.30 U24.40(1A6)
IN_P17: J2.32 U24.38(1A7)
IN_P18: J2.34 U24.37(1A8)
IN_P19: J2.36 U24.36(2A1)
IN_P20: J2.38 U24.35(2A2)
KEY1: J1.40 R91.1
KEY2: J1.38 R92.1
KEY3: J1.36 R93.1
KEY4: J1.34 R94.1
L_P1: J1.30
L_P2: J1.26
L_P3: J1.22
L_P4: J1.18
L_P5: J1.14
L_P6: J1.13
L_P7: J1.15
L_P8: J1.21
L_P9: J1.23
L_P10: J1.29
L_P11: J2.33
L_P12: J2.37
L_P13: J2.41
L_P14: J2.45
L_P15: J2.49
L_P16: J2.53
L_P17: J2.57
L_P18: J2.61
L_P19: J2.65
L_P20: J2.69
LCD_A: LCD1.8(A) LCD2.15(A) P2.2
LCD_CS: J1.68 LCD1.1(CS) LCD2.4(RS)  [also labelled RS]
LCD_RES: J1.66 LCD1.2(RSE) LCD2.5(R/~{W})  [also labelled R/W]
RXD: J1.44 R81.2 U21.7(RXD)
SOC_EXT_1: J5.1 U23.2(1B1)
SOC_EXT_2: J5.3 U23.3(1B2)
SOC_EXT_3: J5.5 U23.5(1B3)
SOC_EXT_4: J5.7 U23.6(1B4)
SOC_EXT_5: J5.9 U23.8(1B5)
SOC_EXT_6: J5.11 U23.9(1B6)
SOC_P1: J5.40 U23.23(2B8)
SOC_P2: J5.38 U23.22(2B7)
SOC_P3: J5.36 U23.20(2B6)
SOC_P4: J5.34 U23.11(1B7)
SOC_P5: J5.32 U23.12(1B8)
SOC_P6: J5.30 U23.13(2B1)
SOC_P7: J5.28 U23.14(2B2)
SOC_P8: J5.26 U23.16(2B3)
SOC_P9: J5.24 U23.17(2B4)
SOC_P10: J5.22 U23.19(2B5)
SOC_P11: J5.21 U24.2(1B1)
SOC_P12: J5.23 U24.3(1B2)
SOC_P13: J5.25 U24.5(1B3)
SOC_P14: J5.27 U24.6(1B4)
SOC_P15: J5.29 U24.8(1B5)
SOC_P16: J5.31 U24.9(1B6)
SOC_P17: J5.33 U24.11(1B7)
SOC_P18: J5.35 U24.12(1B8)
SOC_P19: J5.37 U24.13(2B1)
SOC_P20: J5.39 U24.14(2B2)
SPI_/CS: J1.80 R95.1 U25.1(~{CS})
SPI_CLK: J1.72 R100.2
SPI_D0: J1.74 U25.5(DI(IO0))
SPI_D1: J1.78 U25.2(DO(IO1))
SPI_D2: J1.76 R97.1 U25.3(~{WP}(IO2))
SPI_D3: J1.70 R98.1 U25.7(~{HOLD/RESET}(IO3))
TXD: J1.46 R82.2 U21.6(TXD)
USB_D_N: J4.A7(DN1) J4.B7(DN2) U21.2(UD-)
USB_D_P: J4.A6(DP1) J4.B6(DP2) U21.1(UD+)
NetBT1_1: BT1.1 C5.2 R90.1 R91.2
NetBT2_1: BT2.1 C6.2 R89.1 R92.2
NetBT3_1: BT3.1 C7.2 R88.1 R93.2
NetBT4_1: BT4.1 C8.2 R87.1 R94.2
NetD1_1: D1.1(A) K1.8 Q21.3(D)
NetK1_5: K1.5 R84.1
NetK1_7: K1.7 R85.1
NetL1_2: L1.2(K) R81.1
NetL2_2: L2.2(K) R82.1
NetL3_1: L3.1(A) R102.2
NetL4_1: L4.1(A) R103.2
NetL5_1: L5.1(A) R104.2
NetL6_1: L6.1(A) R105.2
NetL7_1: L7.1(A) R106.2
NetL8_1: L8.1(A) R107.2
NetL9_1: L9.1(A) R108.2
NetL10_1: L10.1(A) R109.2
NetL11_1: L11.1(A) R110.2
NetLCD2_3: LCD2.3(VEE) VR1.2
NetLED21_1: LED21.1(CATHODE_RED) R85.2
NetLED21_3: LED21.3(CATHODE_GREEN) R84.2
NetLS1_1: LS1.1(+) Q22.3(D)
NetQ21_1: Q21.1(G) R86.1 U22.3
NetQ22_1: Q22.1(G) R101.2
NetQ22_2: Q22.2(S) R96.1
NetR83_1: R83.1 U22.1 U22.4
NetR100_1: R100.1 U25.6(CLK)

Not connected (* = marked no-connect by the designer): J1 1* 2* 3* 4* 5* 6* 7* 8* 9* 10* 31* 33* 35* 37* 39* 41* 43* 45* 47* 49* 51* 53* 55* 57* 59* 61* 63* 65* 67* 69* 71* 73* 75* 77* 79*; J2 5* 6* 7* 8* 9* 10* 11* 12* 14* 16* 18* 29* 31* 72* 73* 74* 75* 76* 77* 78* 79* 80*; J3 13* 14* 15* 16* 17* 18* 19* 20* 21* 22* 23* 24* 25* 26* 27* 28* 29* 30* 31* 32* 35* 36* 37* 39* 41* 43* 45* 47* 49* 51* 53* 55* 57* 59* 61* 62* 63* 64* 65* 66* 67* 68* 69* 70* 71* 72* 73* 74* 75* 76* 77* 78* 79* 80*; J4 A5(CC1)* A8(SBU1)* B5(CC2)* B8(SBU2)*; J5 2* 4* 6* 8* 10* 12* 13* 14* 15* 16* 17* 18* 19* 20*; LCD1 10(IC_SC)* 11(IC_CS)* 12(IC_SO)* 13(IC_SI)*; U21 4(RTS#)*; U24 16(2B3)* 17(2B4)* 19(2B5)* 20(2B6)* 22(2B7)* 23(2B8)* 26(2A8)* 27(2A7)* 29(2A6)* 30(2A5)* 32(2A4)* 33(2A3)*

### Layout directives
net class communicate: RXD, TXD, USB_D_N, USB_D_P
differential pair; differential pair class DATA: USB_D_N, USB_D_P
net class DEBUG_LED: DEBUG_L0, DEBUG_L1, DEBUG_L2, DEBUG_L3, DEBUG_L4, DEBUG_L5, DEBUG_L6, DEBUG_L7

### Notes on the sheet
- (in symbol CALVC164245MDGGREP) 5V - 3V3
- (in symbol LCD16x2A) 5V; Vs; |; 0V; R/W; E
- (in symbol Tu Nhom 10uF 16V) +

### Library data of the parts
BT1-BT4 = Nut Nhan 2 Chan SMD 3x6x2.5: Ma_Hang: MH001036; Ten: Nút Nhấn 2 Chân 3x6x2.5MM SMD
C1 C18 = Tu Nhom 10uF 16V: Dán; Don_Vi: Con; So_Chan: 2; Ten_Linh_Kien: Tụ Nhôm 10uF 16V 4x5MM; Ma_Hang: MH001458; Chung_Loai: Dán; Kieu_Chan: *
C2-C9 C19 = Tu 0805 106 16V 10%: as C20 on sheet data_left; Chung_Loai: Dán; Kieu_Chan: *
C10-C17 = Tu 104: Dán; Ten_Linh_Kien: Tụ 0805 104-100nF 10% 50V; Don_Vi: Con; Ma_Hang: MH004551; Kieu_Chan: *; Chung_Loai: Dán; Ghi_Chu: *
D1 = Diode SS14 ( 1N5819): Dán; Ma_Hang: MH002211; Don_Vi: Con; Ten_Linh_Kien: Diode SS14 DO214 Schottky 1A 40V ( 1N5819 DO214); Chung_Loai: Dán; Ghi_Chu: *; Kieu_Chan: *
J1-J3 = 40X2 1.27mm: Connector; Manufacturer_Name: SAMTEC; Manufacturer_Part_Number: CLP-140-02-G-D-A; Datasheet Link: http://suddendocs.samtec.com/prints/erm8-xxx-xx.x-xxx-dv-xxxx-xx-mkt.pdf; Height: 2.37mm
J4 = USB4105-GF-A: No Description Available; Mfr_Name: Global Connector Technology; Copyright: Copyright (C) 2023 Ultra Librarian. All rights reserved.; Manufacturer_Part_Number: USB4105-GF-A; RefDes: RefDes; Type: DEV
J5 = SOCKET DIP 20X2: Mfr_Name: Aries; Manufacturer_Part_Number: 40-6554-10; Type: DEV; Copyright: Copyright (C) 2023 Ultra Librarian. All rights reserved.; RefDes: RefDes
K1 = G6K-2F-Y DC5: RELAY MINI; Mfr_Name: Omron; Copyright: Copyright (C) 2023 Ultra Librarian. All rights reserved.; Manufacturer_Part_Number: G6K-2F-Y DC5; RefDes: RefDes; Type: DEV
L1 L3-L11 = LED 0805 Xanh La: Dán; Don_Vi: Con; Ma_Hang: MH002326; Ten_Linh_Kien: LED 0805 Màu Xanh Lá (Green); Ghi_Chu: *; Kieu_Chan: *; Chung_Loai: Dán
L2 = LED 0805 Do: Dán; Don_Vi: Con; Ma_Hang: MH000897; Ten_Linh_Kien: LED 0805 Màu Đỏ (Red); Ghi_Chu: *; Kieu_Chan: *; Chung_Loai: Dán
LCD2 = LCD16x2A: LCD dipslay 16 char, 2 line; Value: LCD16x2A
LED21 = WP3VEGW: as LED1 on sheet data_left; Datasheet Link: https://www.mouser.com/datasheet/2/216/WP3VEGW-47873.pdf; Height: 6.93mm; Manufacturer_Part_Number: WP3VEGW; Mouser Part Number: 604-WP3VEGW; Mouser Price/Stock: https://www.mouser.co.uk/ProductDetail/Kingbright/WP3VEGW?qs=58z0TXQGVSS6OtgxGPtI4A%3D%3D; Arrow Part Number: WP3VEGW; Arrow Price/Stock: https://www.arrow.com/en/products/wp3vegw/kingbright?region=nac
LS1 = Coi Chip Speaker: Còi chip
P1 = Header 15: Header, 15-Pin; LatestRevisionDate: 17-Jul-2002; LatestRevisionNote: Re-released for DXP Platform.; Publisher: Altium Limited
P2 = Header 3: Header, 3-Pin; LatestRevisionDate: 17-Jul-2002; LatestRevisionNote: Re-released for DXP Platform.; Publisher: Altium Limited
Q21 = AO3400A: as Q1 on sheet data_left; Copyright: Copyright (C) 2023 Ultra Librarian. All rights reserved.; Manufacturer_Part_Number: AO3400A; RefDes: RefDes
Q22 = AO3401A: P-MOSFET; Mfr_Name: Alpha and Omega Semiconductor; Type: DEV; Copyright: Copyright (C) 2023 Ultra Librarian. All rights reserved.; Manufacturer_Part_Number: AO3401A; RefDes: RefDes
R81-R85 R87-R110 = Tro 0805 1% 10k: as R1 on sheet data_left; Chung_Loai: Dán; Kieu_Chan: *
R86 = Tro 0805 5% 10k: Dán; Don_Vi: Con; So_Chan: 2; Ten_Linh_Kien: Trở 0805 5% 10k; Ma_Hang: MH005239; Chung_Loai: Dán; Kieu_Chan: *
SW1 = SW2_BUTT-4-TH: Tactile Switches MINI PUSH BUTTON SWITCH 4-PIN QTY. 4; Manufacturer: Gravitech; Manufacturer Part Number: BUTT-4; Alternate Part Number-1: NA; Case/Package: TH; Supplier-1: SP ROAD; Supplier Part Number-1: BUTT-4
U21 = CH340N: USB to TTL; Manufacturer_Name: Alpha & Omega Semiconductors; Manufacturer_Part_Number: AO4606; Geometry.Height: 1.75mm; Mouser Part Number: *; Mouser Price/Stock: *; Arrow Part Number: AO4606; Arrow Price/Stock: https://www.arrow.com/en/products/ao4606/alpha-and-omega-semiconductor?region=nac; Datasheet Link: https://datasheet.datasheetarchive.com/originals/distributors/Datasheets-AOS/DSAAOS100079.pdf
U22 = PC817X1NIP1B: cach ly quang; Mfr_Name: Sharp; Copyright: Copyright (C) 2023 Ultra Librarian. All rights reserved.; Manufacturer_Part_Number: PC817X1NIP1B; RefDes: RefDes; Type: DEV
U23 U24 = CALVC164245MDGGREP: 3v3-5v, DIR enable; Mfr_Name: Texas Instruments; Copyright: Copyright (C) 2023 Ultra Librarian. All rights reserved.; Manufacturer_Part_Number: CALVC164245MDGGREP; RefDes: RefDes; Type: DEV
U25 = W25Q32: 3v 16m-Bit Serial Flash Memory With Dual; MF: {'manufacturer': u'Winbond Electronics'}; MP: W25Q16JVSSIQ; Availability: Unavailable; Value: *; Package: None; Price: None
VR1 = VR: Var Resistor; Value: VR 10K
LCD1 = GMG12864-06D: LatestRevisionDate: 17-Jul-2002; LatestRevisionNote: Re-released for DXP Platform.; Publisher: Altium Limited

## Nets that join several sheets
3V3: data_left (10 pins), data_right (10 pins), connect (41 pins)
GND: data_left (35 pins), data_right (35 pins), connect (74 pins)
VIC: data_left (25 pins), data_right (25 pins), connect (11 pins)
H_P1: data_left (R2.2 U1.4), connect (J1.28)
H_P2: data_left (R6.2 U2.4), connect (J1.24)
H_P3: data_left (R10.2 U3.4), connect (J1.20)
H_P4: data_left (R14.2 U4.4), connect (J1.16)
H_P5: data_left (R18.2 U5.4), connect (J1.12)
H_P6: data_left (R22.2 U6.4), connect (J1.11)
H_P7: data_left (R26.2 U7.4), connect (J1.17)
H_P8: data_left (R30.2 U8.4), connect (J1.19)
H_P9: data_left (R34.2 U9.4), connect (J1.25)
H_P10: data_left (R38.2 U10.4), connect (J1.27)
H_P11: data_right (R42.2 U11.4), connect (J2.35)
H_P12: data_right (R46.2 U12.4), connect (J2.39)
H_P13: data_right (R50.2 U13.4), connect (J2.43)
H_P14: data_right (R54.2 U14.4), connect (J2.47)
H_P15: data_right (R58.2 U15.4), connect (J2.51)
H_P16: data_right (R62.2 U16.4), connect (J2.55)
H_P17: data_right (R66.2 U17.4), connect (J2.59)
H_P18: data_right (R70.2 U18.4), connect (J2.63)
H_P19: data_right (R74.2 U19.4), connect (J2.67)
H_P20: data_right (R78.2 U20.4), connect (J2.71)
L_P1: data_left (R4.2 U1.2), connect (J1.30)
L_P2: data_left (R8.2 U2.2), connect (J1.26)
L_P3: data_left (R12.2 U3.2), connect (J1.22)
L_P4: data_left (R16.2 U4.2), connect (J1.18)
L_P5: data_left (R20.2 U5.2), connect (J1.14)
L_P6: data_left (R24.2 U6.2), connect (J1.13)
L_P7: data_left (R28.2 U7.2), connect (J1.15)
L_P8: data_left (R32.2 U8.2), connect (J1.21)
L_P9: data_left (R36.2 U9.2), connect (J1.23)
L_P10: data_left (R40.2 U10.2), connect (J1.29)
L_P11: data_right (R44.2 U11.2), connect (J2.33)
L_P12: data_right (R48.2 U12.2), connect (J2.37)
L_P13: data_right (R52.2 U13.2), connect (J2.41)
L_P14: data_right (R56.2 U14.2), connect (J2.45)
L_P15: data_right (R60.2 U15.2), connect (J2.49)
L_P16: data_right (R64.2 U16.2), connect (J2.53)
L_P17: data_right (R68.2 U17.2), connect (J2.57)
L_P18: data_right (R72.2 U18.2), connect (J2.61)
L_P19: data_right (R76.2 U19.2), connect (J2.65)
L_P20: data_right (R80.2 U20.2), connect (J2.69)
SOC_P1: data_left (6 pins), connect (J5.40 U23.23)
SOC_P2: data_left (6 pins), connect (J5.38 U23.22)
SOC_P3: data_left (6 pins), connect (J5.36 U23.20)
SOC_P4: data_left (6 pins), connect (J5.34 U23.11)
SOC_P5: data_left (6 pins), connect (J5.32 U23.12)
SOC_P6: data_left (6 pins), connect (J5.30 U23.13)
SOC_P7: data_left (6 pins), connect (J5.28 U23.14)
SOC_P8: data_left (6 pins), connect (J5.26 U23.16)
SOC_P9: data_left (6 pins), connect (J5.24 U23.17)
SOC_P10: data_left (6 pins), connect (J5.22 U23.19)
SOC_P11: data_right (6 pins), connect (J5.21 U24.2)
SOC_P12: data_right (6 pins), connect (J5.23 U24.3)
SOC_P13: data_right (6 pins), connect (J5.25 U24.5)
SOC_P14: data_right (6 pins), connect (J5.27 U24.6)
SOC_P15: data_right (6 pins), connect (J5.29 U24.8)
SOC_P16: data_right (6 pins), connect (J5.31 U24.9)
SOC_P17: data_right (6 pins), connect (J5.33 U24.11)
SOC_P18: data_right (6 pins), connect (J5.35 U24.12)
SOC_P19: data_right (6 pins), connect (J5.37 U24.13)
SOC_P20: data_right (6 pins), connect (J5.39 U24.14)